# EAGLE design AirSensor (EAGLE 9.6.2)
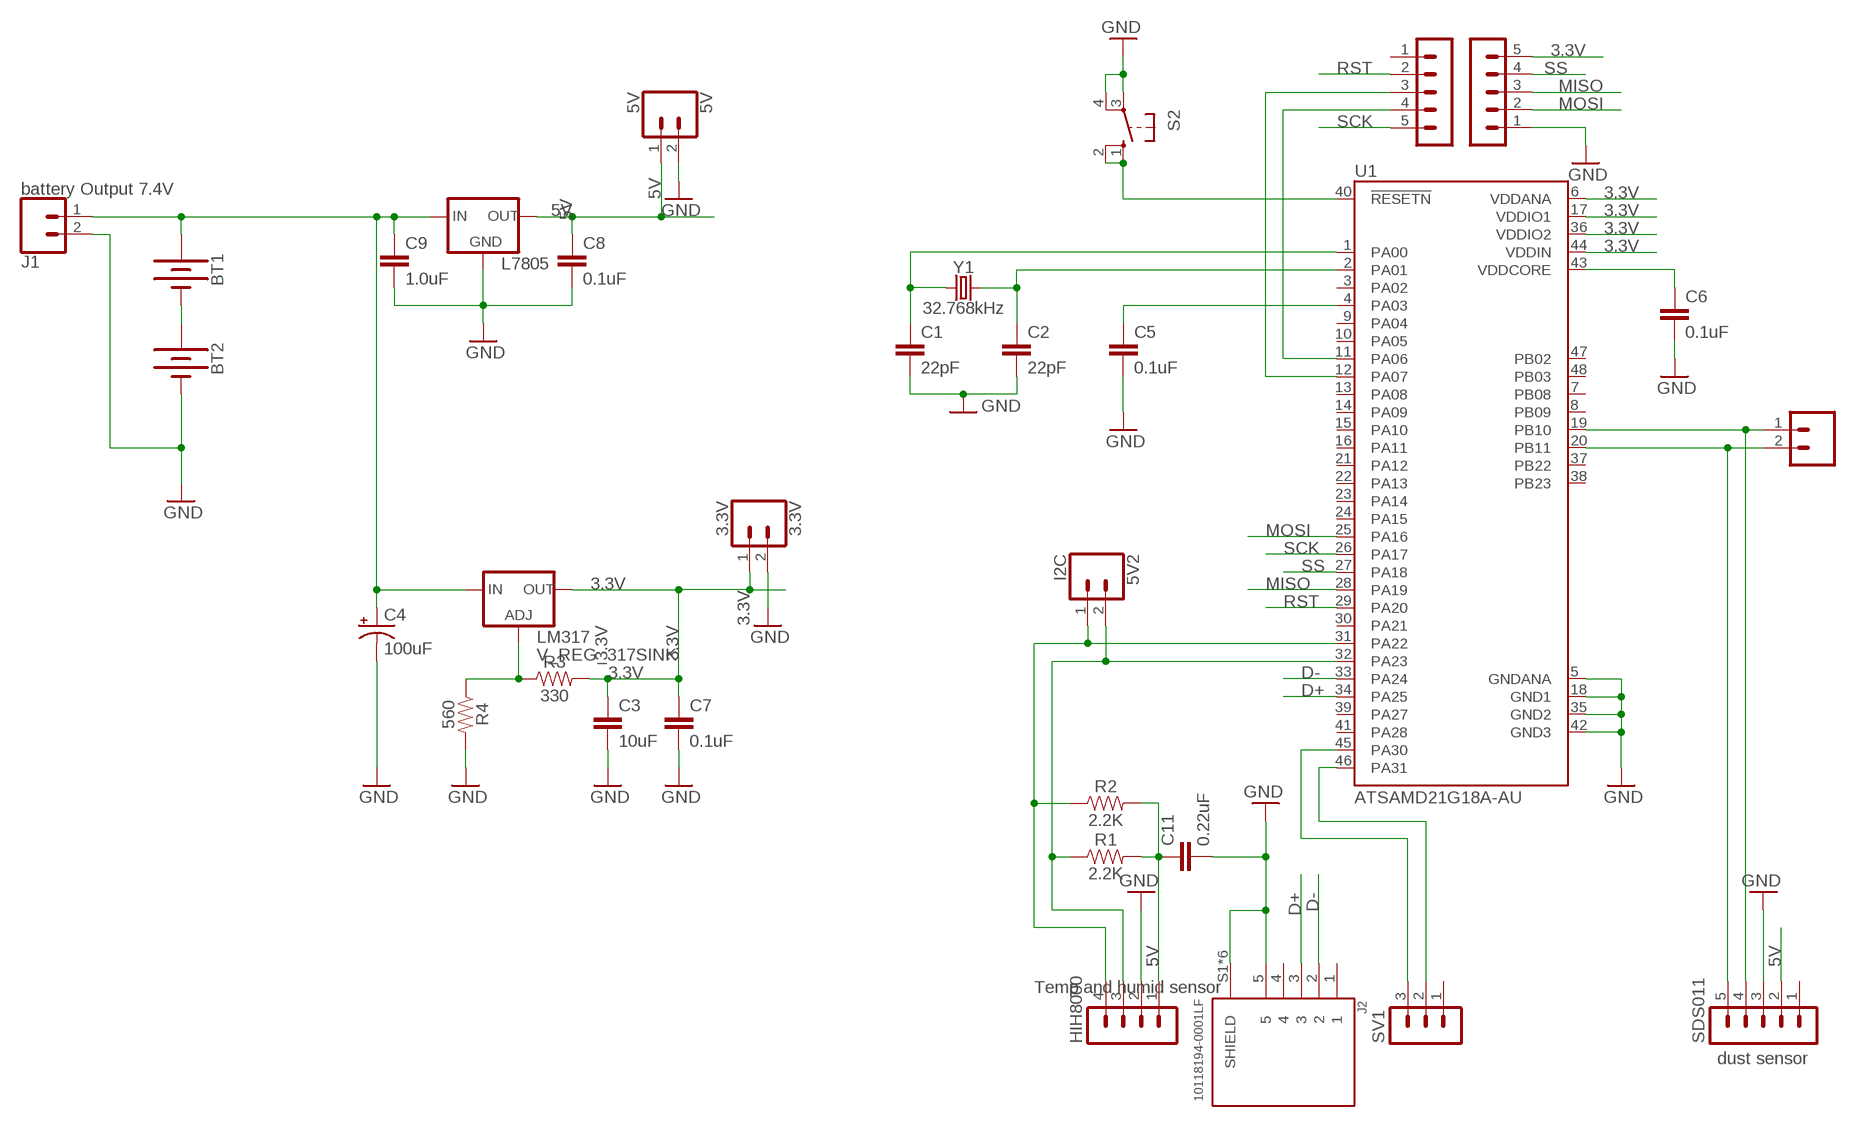
[diagram p0: schematic, sheet 1]

## Parts
3.3V  3.3V  CONN_02  [1X02]
5V  5V  CONN_02  [1X02]
5V1  UART  CONN_02  [1X02]
5V2  I2C  CONN_02  [1X02]
BT1  BATTERY-18650  [BATTERY_18650-HOLDER]
BT2  BATTERY-18650  [BATTERY_18650-HOLDER]
C1  22pF  1.0UF-0805-25V-10%  [0805]
C2  22pF  1.0UF-0805-25V-10%  [0805]
C3  10uF  1.0UF-0805-25V-10%  [0805]
C4  100uF  100UF-POLAR-RADIAL-2.5MM-25V-20%  [CPOL-RADIAL-2.5MM-6.5MM]
C5  0.1uF  1.0UF-0805-25V-10%  [0805]
C6  0.1uF  1.0UF-0805-25V-10%  [0805]
C7  0.1uF  1.0UF-0805-25V-10%  [0805]
C8  0.1uF  1.0UF-0805-25V-10%  [0805]
C9  1.0uF  1.0UF-0805-25V-(+80/-20%)  [0805]
C11  0.22uF  1.0UF-0805-25V-10%  [0805]
HIH8000  Temp and humid sensor  MA04-1  [MA04-1]
J1  battery Output 7.4V  CONN_02  [1X02]
J2  10118194-0001LF  [AMPHENOL_10118194-0001LF]
L7805  V_REG_78XXSINK  [TO220-IGO]
LM317  V_REG_317SINK  [TO220-ADJ]
R1  2.2K  0.3OHM-0805-1/8W-1%  [0805]
R2  2.2K  0.3OHM-0805-1/8W-1%  [0805]
R3  330  0.3OHM-0805-1/8W-1%  [0805]
R4  560  0.3OHM-0805-1/8W-1%  [0805]
RFM95W  LoRa1  MA05-1  [MA05-1]
RFM95W_2  LoRa_2  MA05-1  [MA05-1]
S2  10-XX  [B3F-10XX]
SDS011  dust sensor  MA05-1  [MA05-1]
SV1  MA03-1  [MA03-1]
U1  ATSAMD21G18A-AU  [QFP50P900X900X120-48N]
Y1  32.768kHz  CRYSTAL-32.768KHZSMD-3.2X1.5  [CRYSTAL-SMD-3.2X1.5MM]

## Nets
3.3V: 3.3V.1 C3.1 C7.1 LM317.OUT R3.2 RFM95W_2.5 U1.6(VDDANA) U1.17(VDDIO1) U1.36(VDDIO2) U1.44(VDDIN)
5V: 5V.1 C8.1 C11.1 HIH8000.1 L7805.OUT R1.2 R2.2 SDS011.2
D+: J2.3 U1.34(PA25)
D-: J2.2 U1.33(PA24)
GND: 3.3V.2 5V.2 BT2.GND@1(-) C1.2 C2.2 C3.2 C4.2(-) C5.2 C6.2 C7.2 C8.2 C9.2 C11.2 HIH8000.2 J1.2 J2.5 J2.S1(SHIELD) J2.S2(SHIELD) J2.S3(SHIELD) J2.S4(SHIELD) J2.S5(SHIELD) J2.S6(SHIELD) L7805.GND R4.2 RFM95W_2.1 S2.3(P) S2.4(P1) SDS011.3 U1.5(GNDANA) U1.18(GND1) U1.35(GND2) U1.42(GND3)
MISO: RFM95W_2.3 U1.28(PA19)
MOSI: RFM95W_2.2 U1.25(PA16)
N$1: 5V2.2 HIH8000.3 R1.1 U1.32(PA23)
N$2: 5V1.1 SDS011.4 U1.19(PB10)
N$3: 5V1.2 SDS011.5 U1.20(PB11)
N$4: C5.1 U1.4(PA03)
N$5: C6.1 U1.43(VDDCORE)
N$6: C1.1 U1.1(PA00) Y1.P$1
N$7: LM317.ADJ R3.1 R4.1
N$8: BT1.GND@1(-) BT2.PWR@1(+)
N$9: C2.1 U1.2(PA01) Y1.P$2
N$10: S2.1(S) S2.2(S1) U1.40(!RESETN)
N$11: BT1.PWR@1(+) C4.1(+) C9.1 J1.1 L7805.IN LM317.IN
N$12: 5V2.1 HIH8000.4 R2.1 U1.31(PA22)
N$14: RFM95W.4 U1.11(PA06)
N$15: SV1.3 U1.45(PA30)
N$16: SV1.2 U1.46(PA31)
N$27: RFM95W.3 U1.12(PA07)
RST: RFM95W.2 U1.29(PA20)
SCK: RFM95W.5 U1.26(PA17)
SS: RFM95W_2.4 U1.27(PA18)
Unconnected: J2.1 J2.4 RFM95W.1 SDS011.1 SV1.1 U1.3(PA02) U1.7(PB08) U1.8(PB09) U1.9(PA04) U1.10(PA05) U1.13(PA08) U1.14(PA09) U1.15(PA10) U1.16(PA11) U1.21(PA12) U1.22(PA13) U1.23(PA14) U1.24(PA15) U1.30(PA21) U1.37(PB22) U1.38(PB23) U1.39(PA27) U1.41(PA28) U1.47(PB02) U1.48(PB03)

## Library data of the parts
3.3V 5V 5V1 5V2 J1 = SparkFun-Connectors:CONN_02: Multi connection point. Often used as Generic Header-pin footprint for 0.1 inch spaced/style header connections On any of the 0.1 inch spaced packages, you can populate with these: Break Away Headers - Straight <https://www.sparkfun.com/products/116> (PRT-00116) Break Away Male Headers - Right Angle <https://www.sparkfun.com/products/553> (PRT-00553) Female Headers <https://www.sparkfun.com/products/115> (PRT-00115) Break Away Headers - Machine Pin <https://www.sparkfun.com/products/117> (PRT-00117) Break Away Female Headers - Swiss Machine Pin <https://www.sparkfun.com/products/743> (PRT-00743) For SCREWTERMINALS and SPRING TERMINALS visit here: Screw Terimnals on SparkFun.com <https://www.sparkfun.com/search/results?term=Screw+Terminals> (5mm/3.5mm/2.54mm spacing) This device is also useful as a general connection point to wire up your design to another part of your project. Our various solder wires solder well into these plated through hole pads. Hook-Up Wire - Assortment (Stranded, 22 AWG) <https://www.sparkfun.com/products/11375> (PRT-11375) Hook-Up Wire - Assortment (Solid Core, 22 AWG) <https://www.sparkfun.com/products/11367> (PRT-11367) View the entire wire category on our website here <https://www.sparkfun.com/categories/141> Special notes: Molex polarized connector foot print use with: PRT-08233 with associated crimp pins and housings. 2.54_SCREWTERM for use with PRT-10571. 3.5mm Screw Terminal footprints for PRT-08084 5mm Screw Terminal footprints for use with PRT-08432
BT1 BT2 = SparkFun-Batteries:BATTERY: Battery - Single Cell A variety of battery chemistries, sizes, and footprints. Device List: 20MM_PTH - Coin Cell Battery Holder - 20mm (PTH) <https://www.sparkfun.com/products/783> 6.8MM_PTH - Coin Cell Battery Holder - 6.8MM(SMD) <https://www.digikey.com/product-detail/en/seiko-instruments/MS621FE-FL11E/728-1057-ND/1889208?WT.srch=1&gclid=CNOQ5a6LzdQCFZS2wAodXCkE0g> 12MM_SMD - Coin Cell Battery Holder - 12mm (SMD) <https://www.sparkfun.com/products/10592> 12MM_PTH - Coin Cell Battery Holder - 12mm (PTH) <https://www.sparkfun.com/products/7948> 20MM_SMD - 20mm Coin Cell Battery Holder (SMD) (2 legs) Used on the Big Time Watch Kit <https://www.sparkfun.com/products/11734> 20MM_SMD_4LEGS - Coin Cell Battery Holder - 20mm (SMD) <https://www.sparkfun.com/products/11892> 20MM_SMD_4LEGS_OVERPASTE - Coin Cell Battery Holder - 20mm (SMD) <https://www.sparkfun.com/products/11892> (Over-paste on the legs) 24.5MM_PTH - Coin Cell Battery Holder - 24.5mm (PTH) <https://www.sparkfun.com/products/8863> 9V - 9V Battery Holder - PC Mount Used on the SparkFun SparkPunk Sound Kit <https://www.sparkfun.com/products/11177> and SparkFun SparkPunk Sequencer Kit <https://www.sparkfun.com/products/12707> 18650 - Battery Holder - 18650 (PTH) <https://www.sparkfun.com/products/13113> AA - Battery Holder - 1xAA (PTH) <https://www.sparkfun.com/products/7949> AAA - Battery Holder - 1xAAA (PTH) <https://www.sparkfun.com/products/12718> AA_KIT - Battery Holder - 1xAA (PTH) <https://www.sparkfun.com/products/7949> Special kit package - pads only have exposed copper on one side of the board. AAA_KIT - Battery Holder - 1xAAA (PTH) <https://www.sparkfun.com/products/12718> Special kit package - pads only have exposed copper on one side of the board.; PROD_ID: BATT-12327; SF_SKU: PRT-13113
C1-C3 C5-C8 C11 = SparkFun-Capacitors:1.0UF: 1µF ceramic capacitors A capacitor is a passive two-terminal electrical component used to store electrical energy temporarily in an electric field.; PROD_ID: CAP-08064; VALUE: 1.0uF
C4 = SparkFun-Capacitors:100UF-POLAR: 100µF polarized capacitors A capacitor is a passive two-terminal electrical component used to store electrical energy temporarily in an electric field.; PROD_ID: CAP-08439
C9 = SparkFun-Capacitors:1.0UF: 1µF ceramic capacitors A capacitor is a passive two-terminal electrical component used to store electrical energy temporarily in an electric field.; PROD_ID: CAP-11625
HIH8000 = con-lstb:MA04-1: PIN HEADER; OC_FARNELL: unknown; OC_NEWARK: unknown
J2 = 10118194-0001LF:10118194-0001LF: Micro Usb, 2.0 Type b, Rcpt, Smt Check prices <https://pricing.snapeda.com/search/part/10118194-0001LF/?ref=eda>; AVAILABILITY: Good; DESCRIPTION: USB - micro B USB 2.0 Receptacle Connector 5 Position Surface Mount, Right Angle; Through Hole; MF: Amphenol ICC (FCI); MP: 10118194-0001LF; PACKAGE: None; PRICE: None; PURCHASE-URL: https://pricing.snapeda.com/search/part/10118194-0001LF/?ref=eda
L7805 = SparkFun-IC-Power:V_REG_78XX: Voltage Regulator Standard 78xx regulator. IGO (Input Ground Output). Spark Fun Electronics SKU : COM-00107
LM317 = SparkFun-IC-Power:V_REG_317: Voltage Regulator Standard LM317 adjustable voltage regulator. AOI (Adjust Output Input). Google 'LM317 Calculator' for easy to use app to get the two resistor values needed. 240/720 for 5V output. 240/390 for 3.3V output. Spark Fun Electronics SKU : COM-00527
R1-R4 = SparkFun-Resistors:0.3OHM: 0.3Ω resistor A resistor is a passive two-terminal electrical component that implements electrical resistance as a circuit element. Resistors act to reduce current flow, and, at the same time, act to lower voltage levels within circuits. - Wikipedia; PROD_ID: RES-11622; VALUE: 0.3
RFM95W RFM95W_2 SDS011 = con-lstb:MA05-1: PIN HEADER; OC_FARNELL: unknown; OC_NEWARK: unknown
S2 = switch-omron:10-XX: OMRON SWITCH; MPN: B3F-1000; OC_FARNELL: 176432; OC_NEWARK: 36M3542
SV1 = con-lstb:MA03-1: PIN HEADER; OC_FARNELL: unknown; OC_NEWARK: unknown
U1 = ATSAMD21G18A-AU:ATSAMD21G18A-AU: Cortex-M0+, 256KB FLASH, 32KB SRAM, USB, DMA, T&R - 48TQFP IND TEMP, GREEN, 1.6-3.6V, 48MHz Check prices <https://pricing.snapeda.com/search/part/ATSAMD21G18A-AU/?ref=eda>; AVAILABILITY: Good; DESCRIPTION: ARM® Cortex®-M0+ SAM D21G Microcontroller IC 32-Bit 48MHz 256KB (256K x 8) FLASH 48-TQFP (7x7); MF: Microchip; MP: ATSAMD21G18A-AU; PACKAGE: TQFP-48 Microchip; PRICE: None; PURCHASE-URL: https://pricing.snapeda.com/search/part/ATSAMD21G18A-AU/?ref=eda
Y1 = SparkFun-Clocks:CRYSTAL-32.768KHZ: 32.768kHz Crystal Frequency: 32.768kHz Frequency Stability: ±20ppm Load Capacitance: 12.5pF (PTH-2X6 & SMD-3.2X1.5), 6pF (SMD-2X6) SparkFun Products: SparkFun BigTime Watch Kit <https://www.sparkfun.com/products/11734> SparkFun nRF52832 Breakout <https://www.sparkfun.com/products/13990> SparkFun Real Time Clock Module <https://www.sparkfun.com/products/12708>; PROD_ID: XTAL-13062

## Board
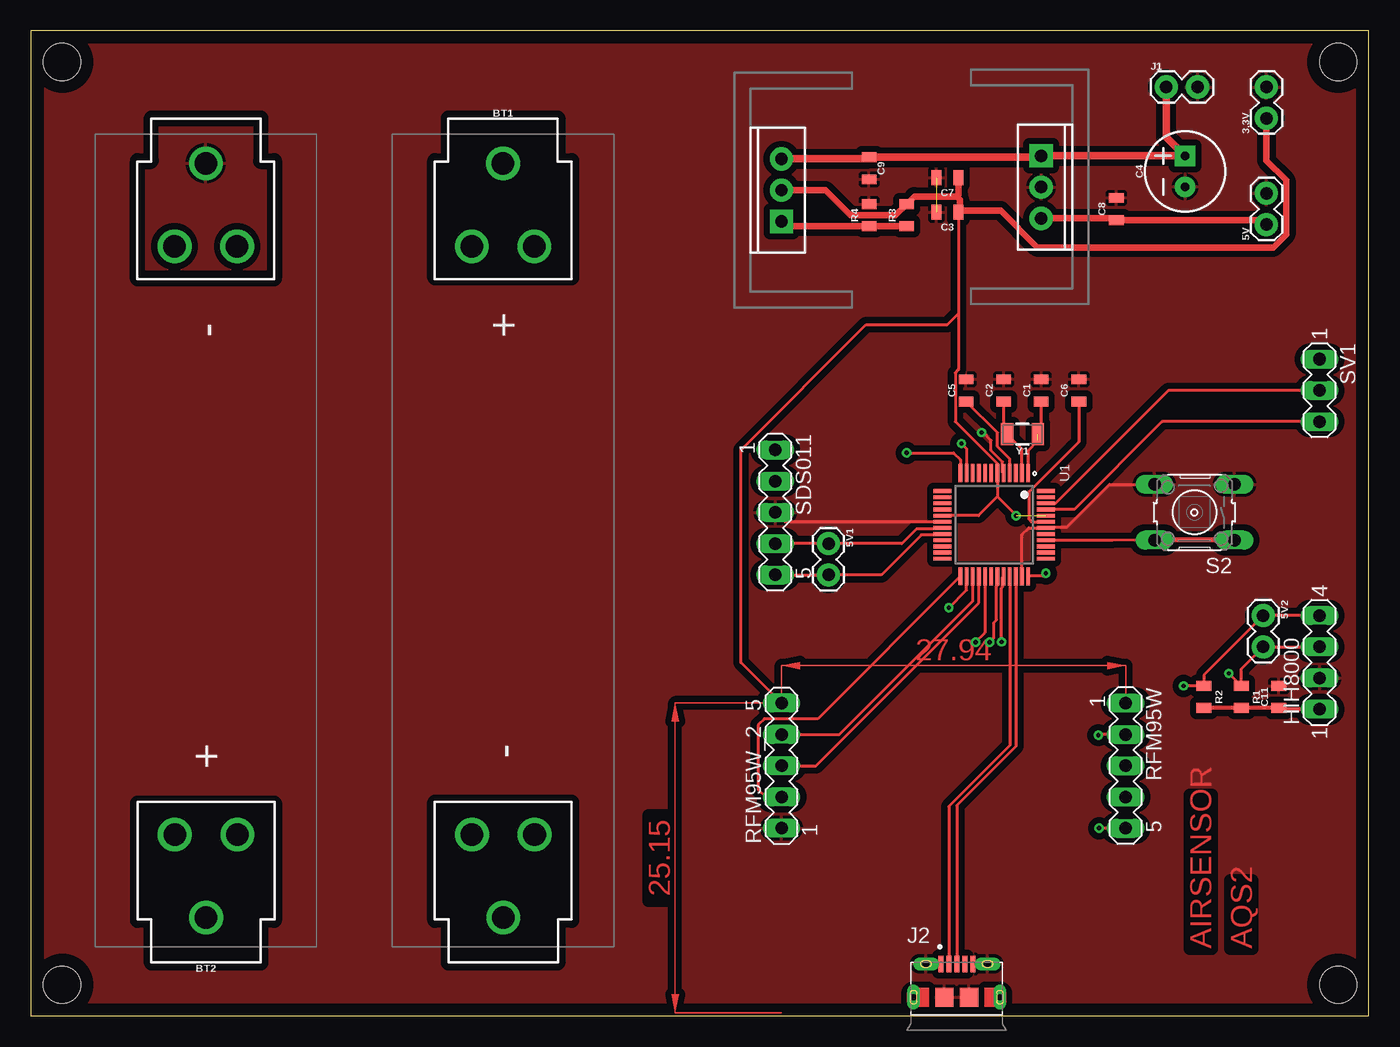
[diagram p1: board, top side]
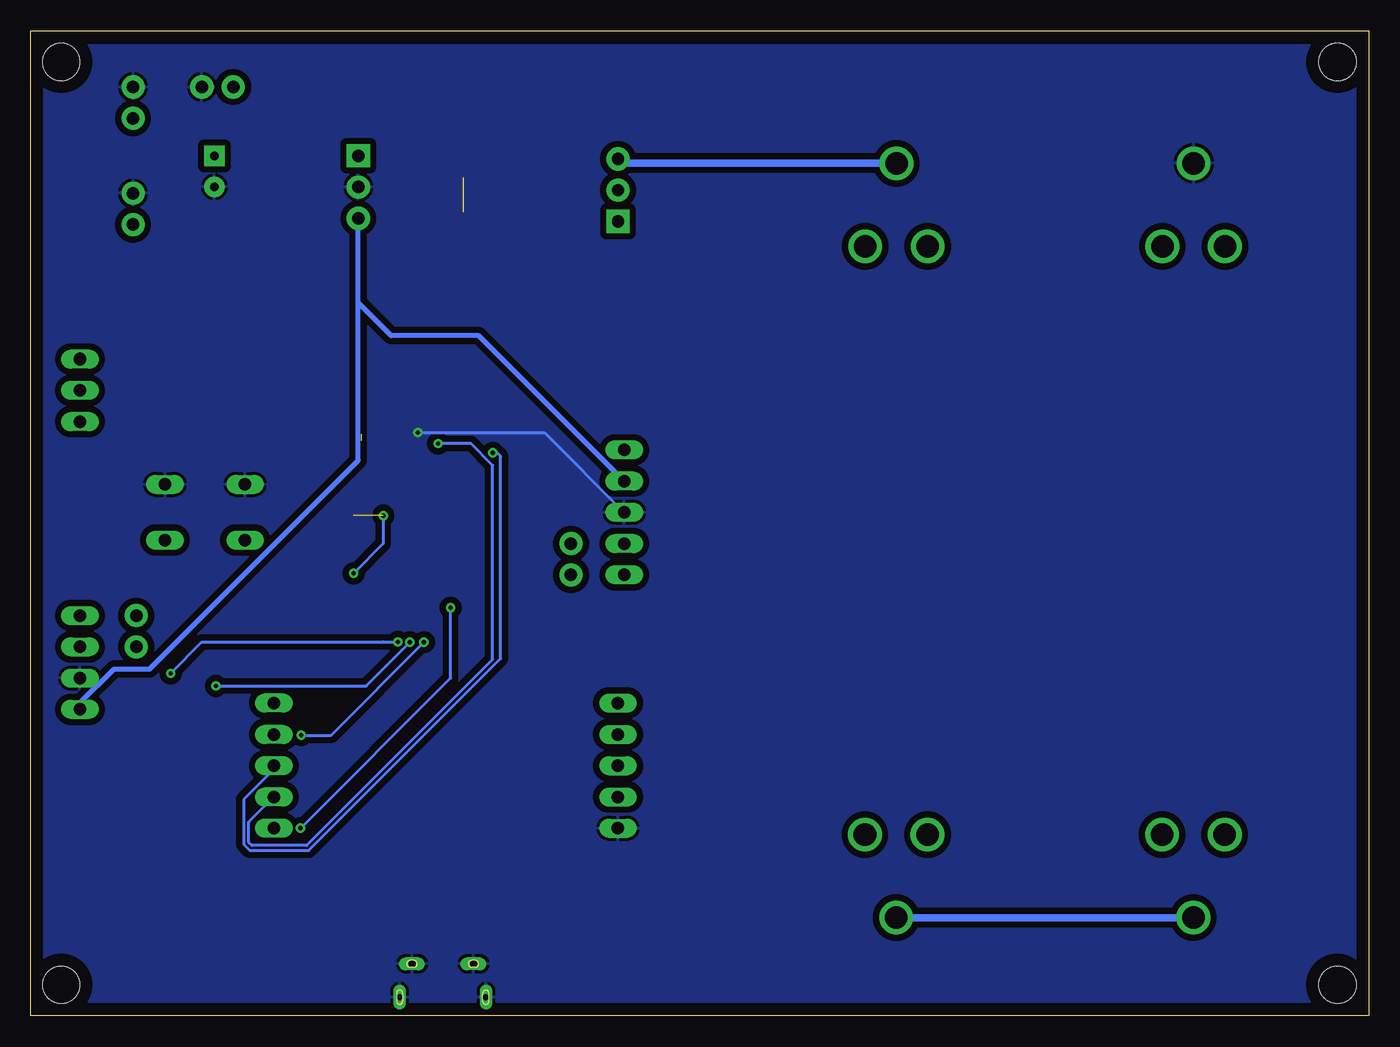
[diagram p2: board, bottom side, seen from below]

Size 108.64 x 80 mm. Coordinates in mm from the lower left corner, seen from the top.
Outline: 0,0 108.64,0 108.64,80 0,80 0,0
Copper layers (1*16): Top 0.035mm / dielectric 1.5mm / Bottom 0.035mm
Design rules "default": minimum track width 6mil, minimum drill 0.35mm, track to track 6mil, track to pad 6mil, pad to pad 6mil, via to via 6mil, smd to smd 6mil, copper to edge 40mil, drill to drill 6mil, minimum pad ring 10mil, minimum via ring 8mil, stop-mask expansion 4mil, vias tented up to drill 0mil, thermal gap 10mil
Holes 3 mm at 2.54,2.54 2.54,77.47 106.17,77.47 106.17,2.54

### Footprints (pad centres in the part's own frame; a part is rotated, then mirrored left to right if it is on the bottom)
1X02 = drill 1.016 pad 1.88: 1 0,0; 2 2.54,0
BATTERY_18650-HOLDER = drill 1.829: GND@1 30.628,0.01; GND@2 23.88,2.55; GND@3 23.88,-2.53; PWR@1 -30.628,-0.01; PWR@2 -23.88,2.53; PWR@3 -23.88,-2.55
0805 = smd 0.8 x 1.2: 1 -0.9,0; 2 0.9,0
CPOL-RADIAL-2.5MM-6.5MM = drill 0.7 pad 1.651 square: 1 1.25,0 | drill 0.7 pad 1.651: 2 -1.25,0
MA04-1 = drill 1.016 long: 1 -3.81,0; 2 -1.27,0; 3 1.27,0; 4 3.81,0
AMPHENOL_10118194-0001LF = smd 0.4 x 1.35: 1 -1.3,2.7; 2 -0.65,2.7; 3 0,2.7; 4 0.65,2.7; 5 1.3,2.7 | drill 0.55 pad 0.65 long: S1 -2.5,2.7; S2 2.5,2.7 | drill 0.5 pad 0.775 long: S3 -3.5,0; S6 3.5,0 | smd 1.5 x 1.55: S4 -1,0; S5 1,0
TO220-IGO = drill 1 pad 1.88: GND 0,0; OUT 2.54,0 | drill 1 pad 1.88 square: IN -2.54,0
TO220-ADJ = drill 1 pad 1.88 square: ADJ -2.54,0 | drill 1 pad 1.88: IN 2.54,0; OUT 0,0
MA05-1 = drill 1.016 long: 1 -5.08,0; 2 -2.54,0; 3 0,0; 4 2.54,0; 5 5.08,0
B3F-10XX = drill 1.016 long: 1 -3.251,2.261; 2 3.251,2.261; 3 -3.251,-2.261; 4 3.251,-2.261
MA03-1 = drill 1.016 long: 1 -2.54,0; 2 0,0; 3 2.54,0
QFP50P900X900X120-48N = smd 1.45 x 0.3: 1 -4.2,2.75; 2 -4.2,2.25; 3 -4.2,1.75; 4 -4.2,1.25; 5 -4.2,0.75; 6 -4.2,0.25; 7 -4.2,-0.25; 8 -4.2,-0.75; 9 -4.2,-1.25; 10 -4.2,-1.75; 11 -4.2,-2.25; 12 -4.2,-2.75; 25 4.17,-2.75; 26 4.2,-2.25; 27 4.2,-1.75; 28 4.2,-1.25; 29 4.2,-0.75; 30 4.2,-0.25; 31 4.2,0.25; 32 4.2,0.75; 33 4.2,1.25; 34 4.2,1.75; 35 4.2,2.25; 36 4.2,2.75 | smd 0.3 x 1.45: 13 -2.75,-4.2; 14 -2.25,-4.2; 15 -1.75,-4.2; 16 -1.25,-4.2; 17 -0.75,-4.2; 18 -0.25,-4.2; 19 0.25,-4.2; 20 0.75,-4.2; 21 1.25,-4.2; 22 1.75,-4.2; 23 2.25,-4.2; 24 2.75,-4.2; 37 2.75,4.2; 38 2.25,4.2; 39 1.75,4.2; 40 1.25,4.2; 41 0.75,4.2; 42 0.25,4.2; 43 -0.25,4.2; 44 -0.75,4.2; 45 -1.25,4.2; 46 -1.75,4.2; 47 -2.25,4.2; 48 -2.75,4.2
CRYSTAL-SMD-3.2X1.5MM = smd 1 x 1.8: P$1 -1.25,0; P$2 1.25,0

### Placement (x,y rotation side)
3.3V  100.33,72.9 90 top
5V  100.33,64.26 90 top
5V1  64.77,38.35 270 top
5V2  100.08,32.51 270 top
BT1  38.35,38.61 270 top
BT2  14.22,38.61 90 top
C1  82.04,50.8 90 top
C2  78.99,50.8 90 top
C3  74.42,65.28 180 top
C4  93.73,68.58 90 top
C5  75.95,50.8 90 top
C6  85.09,50.8 90 top
C7  74.42,68.07 180 top
C8  88.14,65.53 90 top
C9  68.07,68.83 270 top
C11  101.35,25.91 90 top
HIH8000  104.65,28.7 90 top
J1  92.2,75.44 0 top
J2  75.18,1.52 0 top
L7805  82.04,67.31 270 top
LM317  60.96,67.06 90 top
R1  98.3,25.91 270 top
R2  95.25,25.91 270 top
R3  71.12,65.02 90 top
R4  68.07,65.02 90 top
RFM95W  88.9,20.32 270 top
RFM95W_2  60.96,20.32 90 top
S2  94.49,40.89 180 top
SDS011  60.45,40.89 270 top
SV1  104.65,50.8 270 top
U1  78.23,39.88 270 top
Y1  80.52,47.24 180 top

### Tracks (layer width: path | path; a pad name or v marks a point on that pad's centre or on a via)
3.3V  (via drill 0.35)  (1 unrouted)
  Top 0.254: C3.1 75.32,57.03 | 75.32,57.03 75.32,52.47 75.07,52.22 75.07,48.26 78.48,44.85 U1.6 78.48,42.16 | U1.17 76.95,40.63 78.48,42.16 | 78.48,42.16 v80.01,40.63 | U1.36 81.03,35.72 82.2,35.72 v82.42,35.94 | RFM95W_2.5 57.66,28.7 57.66,45.97 67.82,56.13 74.42,56.13 75.32,57.03
  Top 0.508: LM317.OUT 64.52,67.06 66.55,65.02 70.22,65.02 R3.2 71.74,66.55 75.18,66.55 | 75.18,66.55 75.44,66.29 75.44,65.39 | 75.44,65.39 C3.1 | 75.18,66.55 75.32,66.69 C7.1 | 75.44,65.39 78.75,65.39 81.74,62.41 100.89,62.41 101.93,63.45 101.93,67.87 100.33,69.47 3.3V.1
  Bottom 0.254: v80.01,40.63 80.01,38.35 v82.42,35.94
5V
  Top 0.305: HIH8000.1 101.46,24.89 C11.1 R1.2 R2.2
  Top 0.508: L7805.OUT 88,64.77 C8.1 99.96,64.63 5V.1
  Bottom 0.406: SDS011.2 72.26,55.24 79.38,55.24 82.04,57.91 | 82.04,57.91 L7805.OUT | HIH8000.1 104.65,25.4 101.88,28.17 98.98,28.17 82.04,45.1 82.04,57.91
D+
  Top 0.254: U1.34 79.98,21.88 75.18,17.08 J2.3
D-
  Top 0.254: U1.33 79.48,21.95 74.53,17 J2.2
GND  (via drill 0.35)  (1 unrouted)
  Top 0.254: U1.5 78.91,44.15 78.91,44.99 77.98,45.93 77.98,46.74 77.34,47.37 v77.22,47.37 | U1.18 61.22,40.13 SDS011.3 | S2.4 87.58,43.16 84.12,39.7 82.5,39.7 U1.42 81.03,39.63 80.48,39.08 U1.35
  Bottom 0.254: v77.22,47.37 66.93,47.37 SDS011.3
  pour Top (isolate 0.508): 0.76,79.25 0.76,0.76 107.95,0.76 107.95,79.25
  pour Bottom (isolate 0.508): 0.51,79.5 0.51,0.51 108.33,0.51 108.33,79.5
MISO
  Top 0.254: RFM95W_2.3 63.75,20.32 76.98,33.55 U1.28
MOSI
  Top 0.254: U1.25 63.9,24.13 59.56,24.13 59.05,23.62 59.05,18.41 59.69,17.78 RFM95W_2.2
N$1  (via drill 0.35)
  Top 0.254: HIH8000.3 5V2.2 98.3,28.19 R1.1 97.29,27.81 v97.28,27.81 | v78.82,30.37 78.82,34.75 78.91,34.84 78.91,35.61 U1.32
  Bottom 0.254: v97.28,27.81 94.74,30.35 80.08,30.35 80.06,30.37 v78.82,30.37
N$2
  Top 0.254: U1.19 73.96,39.56 71.92,39.56 70.72,38.35 5V1.1 SDS011.4
N$3
  Top 0.254: U1.20 73.96,39.06 72.3,39.06 69.06,35.81 64.9,35.81 5V1.2 SDS011.5
N$4
  Top 0.254: C5.1 78.49,47.36 78.49,46.23 79.48,45.23 U1.4
N$5
  Top 0.254: C6.1 85.09,46.61 81.03,42.55 81.03,40.39 81.28,40.13 U1.43
N$6  (1 unrouted)
  Top 0.254: U1.1 80.98,45.93 81.79,46.74 | Y1.P$1 81.77,47.48 82.04,47.75 C1.1
N$7
  Top 0.508: LM317.ADJ 61.35,64.12 R4.1 R3.1
N$8
  Bottom 0.61: BT2.PWR@1 BT1.GND@1
N$9
  Top 0.254: U1.2 80.48,46.03 Y1.P$2 78.99,47.52 C2.1
N$10
  Top 0.254: S2.2 87.83,38.63 U1.40
  Top 0.406: S2.1 S2.2
N$11
  Top 0.61: LM317.IN 67.93,69.6 C9.1 81.93,69.73 L7805.IN 93.71,69.85 C4.1 92.2,71.35 J1.1
  Bottom 0.61: BT1.PWR@1 60.6,69.24 LM317.IN
N$12  (via drill 0.35)
  Top 0.254: HIH8000.4 5V2.1 95.25,27.69 R2.1 v93.61,26.81 v93.6,26.8 | U1.31 78.49,34.99 78.42,34.92 78.42,32.17 78.17,31.91 78.17,30.67 v77.85,30.35
  Bottom 0.254: v93.6,26.8 81.41,26.8 v77.85,30.35
N$14  (via drill 0.35)
  Top 0.254: v75.56,46.48 75.98,46.06 U1.11
  Bottom 0.254: RFM95W.4 90.93,15.75 90.93,14.1 90.68,13.84 86.23,13.84 71.12,28.96 71.12,44.7 72.9,46.48 v75.56,46.48
N$15
  Top 0.254: SV1.3 91.86,48.26 84.73,41.13 U1.45
N$16
  Top 0.254: SV1.2 92.37,50.8 83.2,41.63 U1.46
N$27  (via drill 0.35)
  Top 0.254: v71.12,45.72 74.93,45.72 75.48,45.17 U1.12
  Bottom 0.254: RFM95W.3 88.9,20.02 91.34,17.58 91.34,13.93 90.85,13.44 86.06,13.44 70.48,29.02 70.48,45.47 70.74,45.72 v71.12,45.72
RST  (via drill 0.35)
  Top 0.254: RFM95W.2 86.87,22.86 86.74,22.73 v86.68,22.8 | v76.71,30.35 77.47,31.11 77.47,35.67 U1.29
  Bottom 0.254: v86.68,22.8 84.26,22.8 v76.71,30.35
SCK  (via drill 0.35)
  Top 0.254: RFM95W.5 v86.74,15.24 | v74.55,33.15 75.98,34.58 U1.26
  Bottom 0.254: v86.74,15.24 74.55,27.43 v74.55,33.15
SS
  Top 0.254: RFM95W_2.4 65.66,22.86 76.48,33.68 U1.27
(copper drawn outside any net)
  shapes: Top area x2

### Text on the board
Top: AIRSENSOR | AQS2